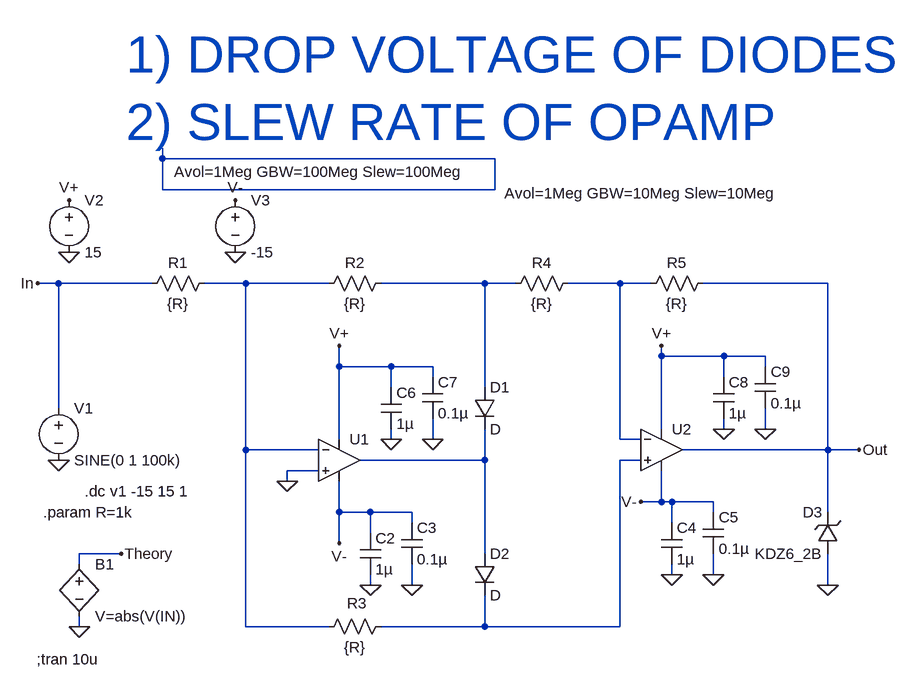
[diagram p0: schematic Absolute Value.asc]
Absolute Value.asc, the LTspice schematic file:
Version 4
SHEET 1 1376 680
WIRE 80 -304 80 -320
WIRE 592 -304 80 -304
WIRE 80 -256 80 -304
WIRE 592 -256 592 -304
WIRE 592 -256 80 -256
WIRE -80 -112 -112 -112
WIRE 64 -112 -80 -112
WIRE 208 -112 144 -112
WIRE 336 -112 208 -112
WIRE 576 -112 416 -112
WIRE 624 -112 576 -112
WIRE 784 -112 704 -112
WIRE 832 -112 784 -112
WIRE 1104 -112 912 -112
WIRE 848 0 848 -16
WIRE 944 0 848 0
WIRE 1008 0 944 0
WIRE 352 16 352 -16
WIRE 432 16 352 16
WIRE 496 16 432 16
WIRE 1008 16 1008 0
WIRE 496 32 496 16
WIRE 944 32 944 0
WIRE 432 48 432 16
WIRE 576 48 576 -112
WIRE -80 80 -80 -112
WIRE 848 112 848 0
WIRE 944 112 944 96
WIRE 1008 112 1008 80
WIRE 352 128 352 16
WIRE 432 128 432 112
WIRE 496 128 496 96
WIRE 784 128 784 -112
WIRE 816 128 784 128
WIRE 208 144 208 -112
WIRE 320 144 208 144
WIRE 1104 144 1104 -112
WIRE 1104 144 880 144
WIRE 1152 144 1104 144
WIRE 576 160 576 112
WIRE 576 160 384 160
WIRE 816 160 784 160
WIRE 320 176 272 176
WIRE 272 192 272 176
WIRE 848 224 848 176
WIRE 848 224 816 224
WIRE 864 224 848 224
WIRE 928 224 864 224
WIRE 352 240 352 192
WIRE 400 240 352 240
WIRE 464 240 400 240
WIRE 928 240 928 224
WIRE 1104 240 1104 144
WIRE 464 256 464 240
WIRE 864 256 864 224
WIRE 400 272 400 240
WIRE 352 288 352 240
WIRE 16 304 -48 304
WIRE 576 304 576 160
WIRE -48 320 -48 304
WIRE 864 336 864 320
WIRE 928 336 928 304
WIRE 400 352 400 336
WIRE 464 352 464 320
WIRE 1104 352 1104 304
WIRE -48 416 -48 400
WIRE 208 416 208 144
WIRE 336 416 208 416
WIRE 576 416 576 368
WIRE 576 416 416 416
WIRE 784 416 784 160
WIRE 784 416 576 416
FLAG -80 160 0
FLAG -64 -160 0
FLAG -64 -240 V+
FLAG 192 -160 0
FLAG 192 -240 V-
FLAG 352 288 V-
FLAG 352 -16 V+
FLAG 272 192 0
FLAG 816 224 V-
FLAG 848 -16 V+
FLAG 1152 144 Out
FLAG 464 352 0
FLAG 400 352 0
FLAG 928 336 0
FLAG 864 336 0
FLAG 496 128 0
FLAG 432 128 0
FLAG 1008 112 0
FLAG 944 112 0
FLAG -112 -112 In
FLAG -48 416 0
FLAG 16 304 Theory
FLAG 1104 352 0
SYMBOL voltage -80 64 R0
WINDOW 123 0 0 Left 0
WINDOW 39 0 0 Left 0
SYMATTR InstName V1
SYMATTR Value SINE(0 1 100k)
SYMBOL res 160 -128 R90
WINDOW 0 0 56 VBottom 2
WINDOW 3 32 56 VTop 2
SYMATTR InstName R1
SYMATTR Value {R}
SYMBOL res 432 -128 R90
WINDOW 0 0 56 VBottom 2
WINDOW 3 32 56 VTop 2
SYMATTR InstName R2
SYMATTR Value {R}
SYMBOL voltage -64 -256 R0
SYMATTR InstName V2
SYMATTR Value 15
SYMBOL voltage 192 -256 R0
SYMATTR InstName V3
SYMATTR Value -15
SYMBOL res 432 400 R90
WINDOW 0 -4 53 VBottom 2
WINDOW 3 32 56 VTop 2
SYMATTR InstName R3
SYMATTR Value {R}
SYMBOL res 720 -128 R90
WINDOW 0 0 56 VBottom 2
WINDOW 3 32 56 VTop 2
SYMATTR InstName R4
SYMATTR Value {R}
SYMBOL res 928 -128 R90
WINDOW 0 0 56 VBottom 2
WINDOW 3 32 56 VTop 2
SYMATTR InstName R5
SYMATTR Value {R}
SYMBOL cap 384 272 R0
SYMATTR InstName C2
SYMATTR Value 1µ
SYMBOL cap 448 256 R0
SYMATTR InstName C3
SYMATTR Value 0.1µ
SYMBOL cap 848 256 R0
SYMATTR InstName C4
SYMATTR Value 1µ
SYMBOL cap 912 240 R0
SYMATTR InstName C5
SYMATTR Value 0.1µ
SYMBOL cap 416 48 R0
SYMATTR InstName C6
SYMATTR Value 1µ
SYMBOL cap 480 32 R0
SYMATTR InstName C7
SYMATTR Value 0.1µ
SYMBOL cap 928 32 R0
SYMATTR InstName C8
SYMATTR Value 1µ
SYMBOL cap 992 16 R0
SYMATTR InstName C9
SYMATTR Value 0.1µ
SYMBOL bv -48 304 R0
SYMATTR InstName B1
SYMATTR Value V=abs(V(IN))
SYMBOL diode 560 48 R0
SYMATTR InstName D1
SYMBOL diode 560 304 R0
SYMATTR InstName D2
SYMBOL OpAmps\\UniversalOpamp2 352 160 R0
WINDOW 123 -254 -444 Left 2
SYMATTR InstName U1
SYMATTR Value2 Avol=1Meg GBW=100Meg Slew=100Meg
SYMBOL OpAmps\\UniversalOpamp2 848 144 R0
WINDOW 123 -242 -395 Left 2
SYMATTR InstName U2
SYMBOL zener 1120 304 R180
WINDOW 0 24 64 Left 2
WINDOW 3 24 0 Left 2
SYMATTR InstName D3
SYMATTR Value KDZ6_2B
SYMATTR Description Diode
SYMATTR Type diode
TEXT -104 240 Left 2 !.param R=1k
TEXT -114 466 Left 2 !;tran 10u
TEXT 24 -464 Left 6 ;1) DROP VOLTAGE OF DIODES\n2) SLEW RATE OF OPAMP
TEXT -40 208 Left 2 !.dc v1 -15 15 1

The netlist it stands for:
* Absolute Value.asc
V1 In 0 SINE(0 1 100k)
R1 N002 In {R}
R2 N003 N002 {R}
V2 V+ 0 15
V3 V- 0 -15
R3 N006 N002 {R}
R4 N004 N003 {R}
R5 Out N004 {R}
C2 V- 0 1µ
C3 V- 0 0.1µ
C4 V- 0 1µ
C5 V- 0 0.1µ
C6 V+ 0 1µ
C7 V+ 0 0.1µ
C8 V+ 0 1µ
C9 V+ 0 0.1µ
B1 Theory 0 V=abs(V(IN))
D1 N003 N005 D
D2 N005 N006 D
XU1 0 N002 V+ V- N005 level.2 Avol=1Meg GBW=100Meg Slew=100Meg ilimit=25m rail=0 Vos=0 phimargin=45 en=0 enk=0 in=0 ink=0 Rin=500Meg  ; pins IN+ IN- V+ V- OUT
XU2 N006 N004 V+ V- Out level.2 Avol=1Meg GBW=10Meg Slew=10Meg ilimit=25m rail=0 Vos=0 phimargin=45 en=0 enk=0 in=0 ink=0 Rin=500Meg  ; pins IN+ IN- V+ V- OUT
D3 0 Out KDZ6_2B
.model D D
.lib standard.dio
.param R=1k
;tran 10u
* 1) DROP VOLTAGE OF DIODES
* 2) SLEW RATE OF OPAMP
.dc v1 -15 15 1
.lib UniversalOpamps2.sub
.backanno
.end